# Altium project ECG Main Board.PrjPcb
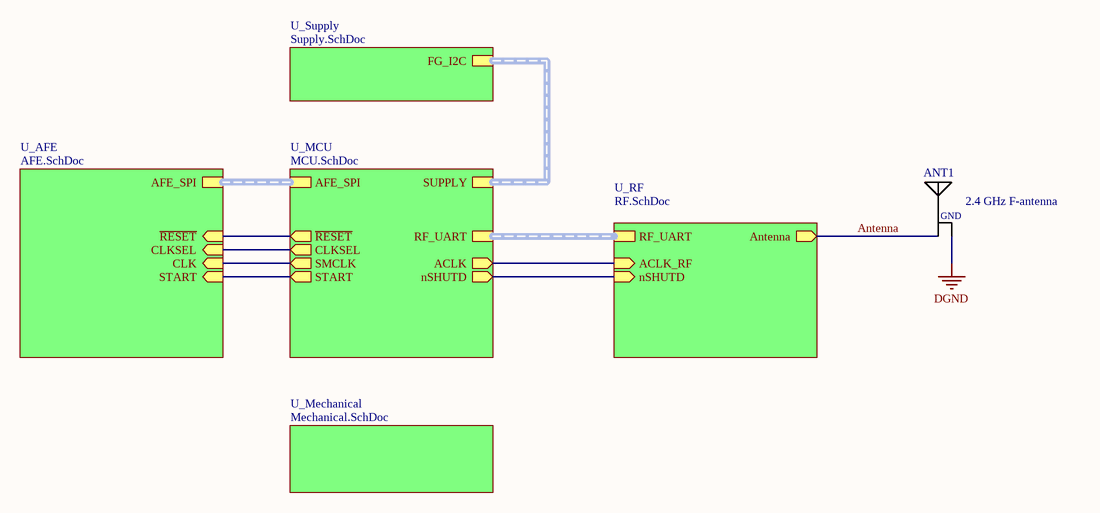
[diagram p0: Main Board.SchDoc]
6 sheets, 105 parts. Net scope: hierarchical (ports join the sheet entries above them; power ports are global).
Board file: Main Board.PcbDoc
Sheets:
  Main Board.SchDoc
    U_AFE = AFE.SchDoc
    U_MCU = MCU.SchDoc
    U_Supply = Supply.SchDoc
    U_RF = RF.SchDoc
    U_Mechanical = Mechanical.SchDoc

## Sheet Main Board.SchDoc: ECG Main Board
size A4; Author: Tomás Valencia/Samuel López; DrawnBy: Tomás Valencia; DocumentNumber: 1; SheetNumber: 1; SheetTotal: 6

### Parts
ANT1  2.4 GHz F-antenna  [Antenna]  (net tie, no BOM)

### Sub-sheets
U_AFE = AFE.SchDoc: AFE_SPI (harness AFE_SPI), CLKSEL (in), CLK (in), START (in), ~{RESET} (in)
U_MCU = MCU.SchDoc: AFE_SPI (harness AFE_SPI), RF_UART (harness RF_UART), ACLK (out), SUPPLY (harness SUPPLY), SMCLK (out), CLKSEL (out), START (out), nSHUTD (out), ~{RESET} (out)
U_Mechanical = Mechanical.SchDoc: no entries
U_RF = RF.SchDoc: RF_UART (harness RF_UART), ACLK_RF (in), Antenna (out), nSHUTD (in)
U_Supply = Supply.SchDoc: FG_I2C (harness SUPPLY)

### Nets
DGND: ANT1.2(GND)
ACLK_RF_DVDD: sheet U_MCU/ACLK, sheet U_RF/ACLK_RF
AFE_CLK: sheet U_AFE/CLK, sheet U_MCU/SMCLK
AFE_CLKSEL: sheet U_AFE/CLKSEL, sheet U_MCU/CLKSEL
AFE_RESET: sheet U_AFE/~{RESET}, sheet U_MCU/~{RESET}
AFE_START: sheet U_AFE/START, sheet U_MCU/START
Antenna: ANT1.1(IN) ; sheet U_RF/Antenna
nSHUTD_DVDD: sheet U_MCU/nSHUTD, sheet U_RF/nSHUTD

### Buses and harness runs
harness sheet U_AFE/AFE_SPI = sheet U_MCU/AFE_SPI
harness sheet U_MCU/RF_UART = sheet U_RF/RF_UART
harness sheet U_MCU/SUPPLY = sheet U_Supply/FG_I2C

### Library data of the parts
ANT1 = Antenna

## Sheet AFE.SchDoc: AFE
size A4; Author: Samuel López; DrawnBy: Samuel López; DocumentNumber: 2; SheetNumber: 2; SheetTotal: 6
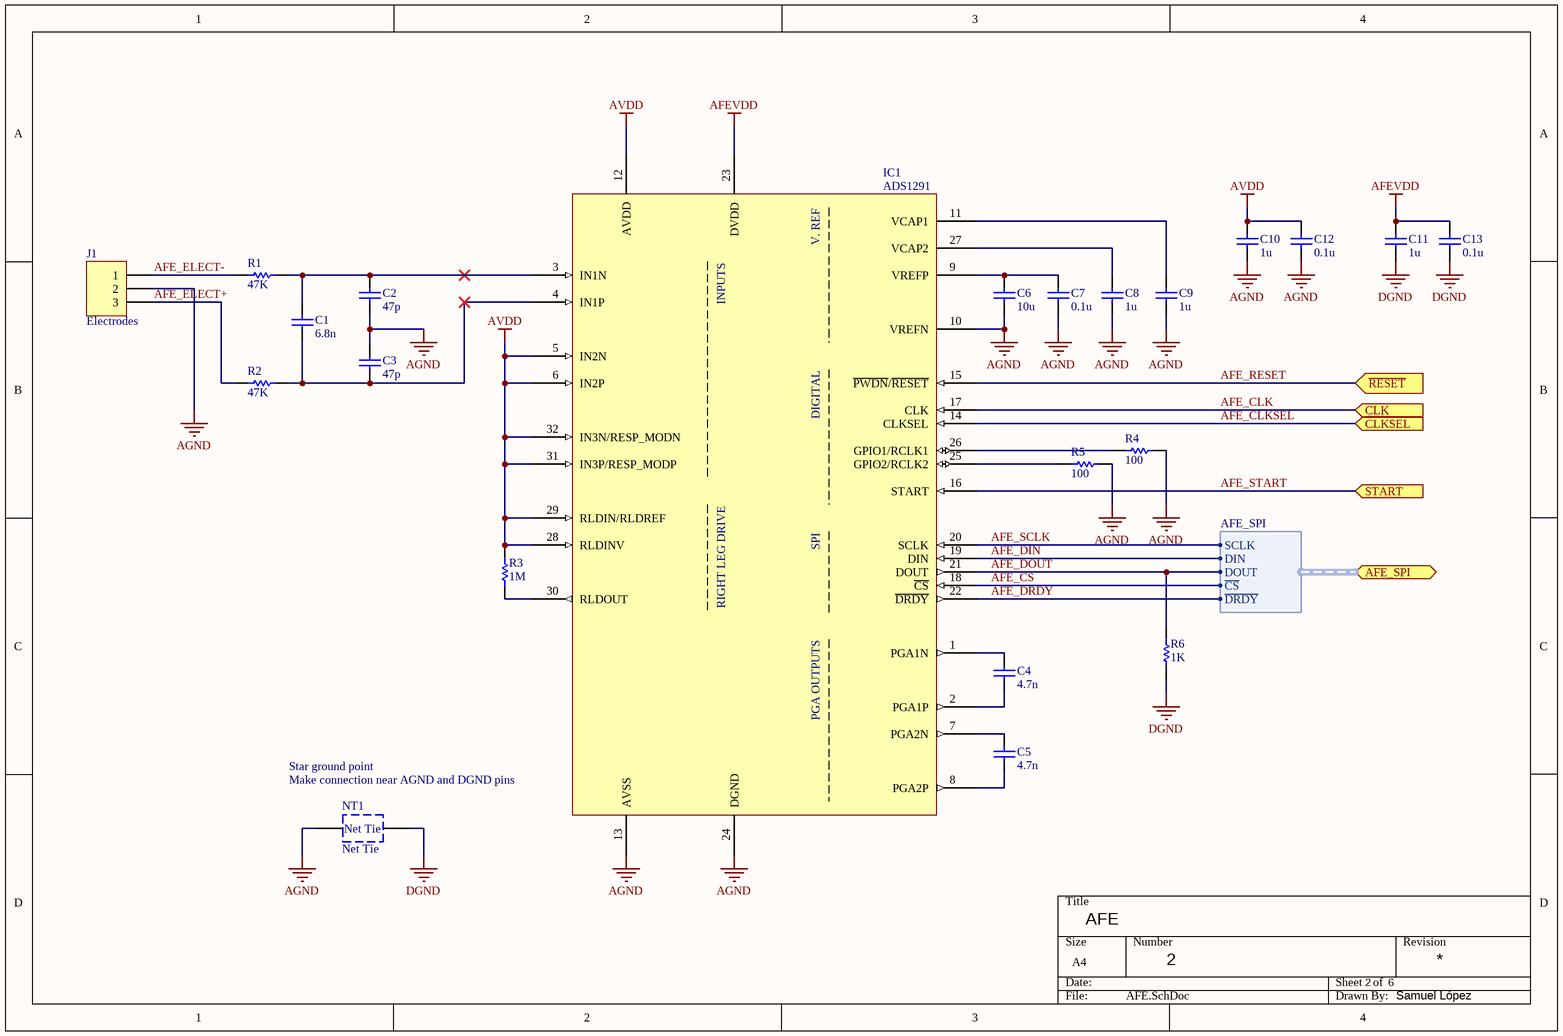
[diagram p1: AFE.SchDoc]

### Parts
C1  6.8n  [C0603]
C2  47p  [C0603]
C3  47p  [C0603]
C4  4.7n  [C0603]
C5  4.7n  [C0603]
C6  10u  [C0603]
C7  0.1u  [C0603]
C8  1u  [C0603]
C9  1u  [C0603]
C10  1u  [C0603]
C11  1u  [C0603]
C12  0.1u  [C0603]
C13  0.1u  [C0603]
IC1  ADS1291  [TSQFP50P700X700X120-32N]
J1  Electrodes  [JST PH 3 Socket]
NT1  Net Tie  [Net Tie (AGND-DGND)]  (net tie, no BOM)
R1  47K  [R0603]
R2  47K  [R0603]
R3  1M  [R0603]
R4  100  [R0603]
R5  100  [R0603]
R6  1K  [R0603]

### Ports
AFE_SPI (harness AFE_SPI), CLK (in), CLKSEL (in), START (in), ~{RESET} (in)

### Harnesses
AFE_SPI: SCLK, DIN, DOUT, ~{CS}, ~{DRDY}

### Nets
AFEVDD: C11.2 C13.2 IC1.23(DVDD)
AGND: C2.1 C3.2 C6.1 C7.1 C8.1 C9.1 C10.1 C12.1 IC1.10(VREFN) IC1.13(AVSS) IC1.24(DGND) J1.2 NT1.1 R4.2 R5.2
AVDD: C10.2 C12.2 IC1.5(IN2N) IC1.6(IN2P) IC1.12(AVDD) IC1.28(RLDINV) IC1.29(RLDIN/RLDREF) IC1.31(IN3P/RESP_MODP) IC1.32(IN3N/RESP_MODN) R3.2
DGND: C11.1 C13.1 NT1.2 R6.1
AFE_CLK: IC1.17(CLK) ; port CLK
AFE_CLKSEL: IC1.14(CLKSEL) ; port CLKSEL
AFE_CS: IC1.18(~{CS}) ; port AFE_SPI.~{CS}
AFE_DIN: IC1.19(DIN) ; port AFE_SPI.DIN
AFE_DOUT: IC1.21(DOUT) R6.2 ; port AFE_SPI.DOUT
AFE_DRDY: IC1.22(~{DRDY}) ; port AFE_SPI.~{DRDY}
AFE_ELECT+: J1.3 R2.1
AFE_ELECT-: J1.1 R1.1
AFE_RESET: IC1.15(~{PWDN}/~{RESET}) ; port ~{RESET}
AFE_SCLK: IC1.20(SCLK) ; port AFE_SPI.SCLK
AFE_START: IC1.16(START) ; port START
NetC1_1: C1.1 C3.1 IC1.4(IN1P) R2.2
NetC1_2: C1.2 C2.2 IC1.3(IN1N) R1.2
NetC4_1: C4.1 IC1.2(PGA1P)
NetC4_2: C4.2 IC1.1(PGA1N)
NetC5_1: C5.1 IC1.8(PGA2P)
NetC5_2: C5.2 IC1.7(PGA2N)
NetC6_2: C6.2 C7.2 IC1.9(VREFP)
NetC8_2: C8.2 IC1.27(VCAP2)
NetC9_2: C9.2 IC1.11(VCAP1)
NetIC1_25: IC1.25(GPIO2/RCLK2) R5.1
NetIC1_26: IC1.26(GPIO1/RCLK1) R4.1
NetIC1_30: IC1.30(RLDOUT) R3.1

### Notes on the sheet
- Star ground point
- Make connection near AGND and DGND pins
- (in symbol ADS1291) V. REF; INPUTS; DIGITAL; RIGHT LEG DRIVE; SPI; PGA OUTPUTS

### Library data of the parts
C1-C13 = Capacitor: Rated Voltage: *
  C1: Value: 6.8n
  C2 C3: Value: 47p
  C4 C5: Value: 4.7n
  C6: Value: 10u
  C7 C12 C13: Value: 0.1u
  C8-C11: Value: 1u
J1 = JST PH 3 Pin Socket: Supplier 1: Digi-Key; Supplier Part Number 1: 455-1720-ND
NT1 = Net Tie: Net Tie (AGND-DGND)
R1-R6 = Resistor: Power: *
  R1 R2: Value: 47K
  R3: Value: 1M
  R4 R5: Value: 100
  R6: Value: 1K
IC1 = ADS1291: Supplier 1: Digi-Key; Supplier Part Number 1: 296-36547-5-ND

## Sheet MCU.SchDoc: MCU
size A3; Author: Tomás Valencia; DrawnBy: Tomás Valencia; DocumentNumber: 3; SheetNumber: 3; SheetTotal: 6
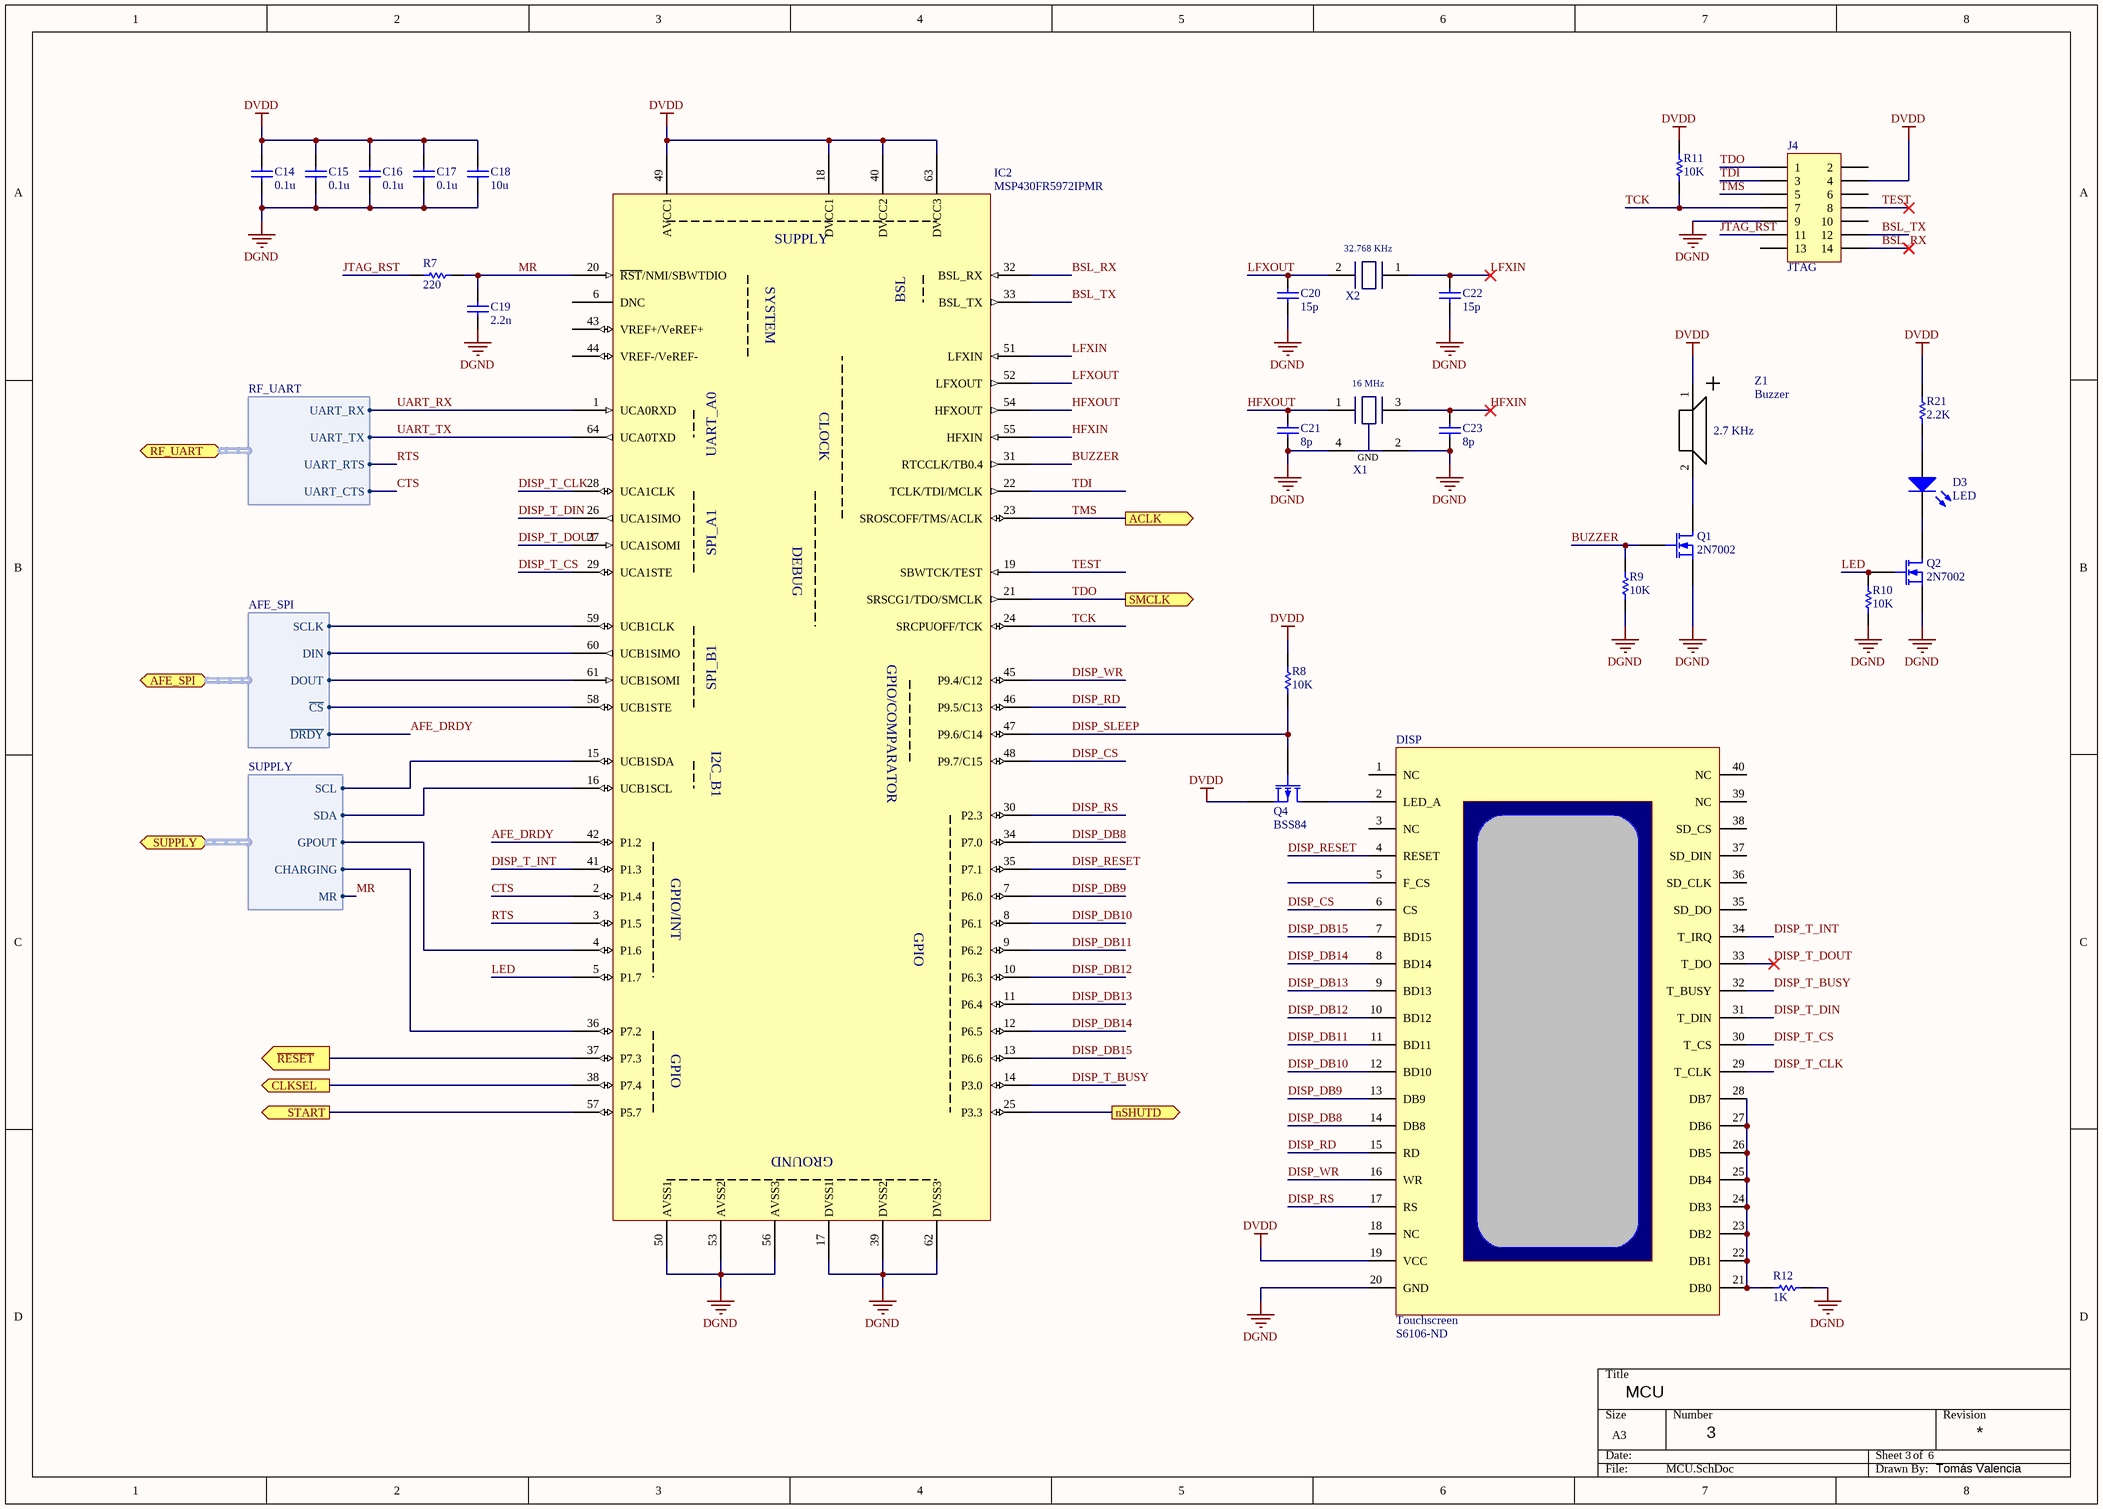
[diagram p2: MCU.SchDoc]

### Parts
C14  0.1u  [C0603]
C15  0.1u  [C0603]
C16  0.1u  [C0603]
C17  0.1u  [C0603]
C18  10u  [C0603]
C19  2.2n  [C0603]
C20  15p  [C0603]
C21  8p  [C0603]
C22  15p  [C0603]
C23  8p  [C0603]
D3  LED  [LED3015M]
DISP  Touchscreen  Supplier Part Number 1: S6106-ND  [TSCREEN_CONN]
IC2  MSP430FR5972IPMR  [MSP430FR5972]
J4  JTAG  [JTAG 14 PINS]
Q1  2N7002  [SOT65P210X110-3N]
Q2  2N7002  [SOT65P210X110-3N]
Q4  BSS84  [SOT65P210X110-3N]
R7  220  [R0603]
R8  10K  [R0603]
R9  10K  [R0603]
R10  10K  [R0603]
R11  10K  [R0603]
R12  1K  [R0603]
R21  2.2K  [R0603]
X1  XTAL_16MHZ  [XTAL_16_MHz]  (value not drawn)
X2  XTAL_32768  [xtal_32768]  (value not drawn)
Z1  Buzzer  [KSSG74B16]

### Ports
ACLK (out), AFE_SPI (harness AFE_SPI), CLKSEL (out), nSHUTD (out), RF_UART (harness RF_UART), SMCLK (out), START (out), SUPPLY (harness SUPPLY), ~{RESET} (out)

### Harnesses
AFE_SPI: SCLK, DIN, DOUT, ~{CS}, ~{DRDY}
RF_UART: UART_TX, UART_RX, UART_RTS, UART_CTS
SUPPLY: SDA, SCL, GPOUT, CHARGING, MR

### Nets
DGND: C14.1 C15.1 C16.1 C17.1 C18.1 C19.1 C20.2 C21.1 C22.2 C23.1 DISP.20(GND) IC2.17(DVSS1) IC2.39(DVSS2) IC2.50(AVSS1) IC2.53(AVSS2) IC2.56(AVSS3) IC2.62(DVSS3) J4.9 Q1.2(S) Q2.2(S) R9.1 R10.1 R12.2 X1.2(GND) X1.4(GND)
DVDD: C14.2 C15.2 C16.2 C17.2 C18.2 DISP.19(VCC) IC2.18(DVCC1) IC2.40(DVCC2) IC2.49(AVCC1) IC2.63(DVCC3) J4.4 Q4.2(S) R8.2 R11.2 R21.2 Z1.1(+)
AFE_CLKSEL: IC2.38(P7.4) ; port CLKSEL
AFE_CS: IC2.58(UCB1STE) ; port AFE_SPI.~{CS}
AFE_DIN: IC2.60(UCB1SIMO) ; port AFE_SPI.DIN
AFE_DOUT: IC2.61(UCB1SOMI) ; port AFE_SPI.DOUT
AFE_DRDY: IC2.42(P1.2) ; port AFE_SPI.~{DRDY}
AFE_RESET: IC2.37(P7.3) ; port ~{RESET}
AFE_SCLK: IC2.59(UCB1CLK) ; port AFE_SPI.SCLK
AFE_START: IC2.57(P5.7) ; port START
BSL_RX: IC2.32(BSL_RX) J4.14
BSL_TX: IC2.33(BSL_TX) J4.12
BUZZER: IC2.31(RTCCLK/TB0.4) Q1.1(G) R9.2
Charging: IC2.36(P7.2) ; port SUPPLY.CHARGING
CTS: IC2.2(P1.4) ; port RF_UART.UART_CTS
DISP_CS: DISP.6(CS) IC2.48(P9.7/C15)
DISP_DB8: DISP.14(DB8) IC2.34(P7.0)
DISP_DB9: DISP.13(DB9) IC2.7(P6.0)
DISP_DB10: DISP.12(BD10) IC2.8(P6.1)
DISP_DB11: DISP.11(BD11) IC2.9(P6.2)
DISP_DB12: DISP.10(BD12) IC2.10(P6.3)
DISP_DB13: DISP.9(BD13) IC2.11(P6.4)
DISP_DB14: DISP.8(BD14) IC2.12(P6.5)
DISP_DB15: DISP.7(BD15) IC2.13(P6.6)
DISP_RD: DISP.15(RD) IC2.46(P9.5/C13)
DISP_RESET: DISP.4(RESET) IC2.35(P7.1)
DISP_RS: DISP.17(RS) IC2.30(P2.3)
DISP_SLEEP: IC2.47(P9.6/C14) Q4.1(G) R8.1
DISP_T_BUSY: DISP.32(T_BUSY) IC2.14(P3.0)
DISP_T_CLK: DISP.29(T_CLK) IC2.28(UCA1CLK)
DISP_T_CS: DISP.30(T_CS) IC2.29(UCA1STE)
DISP_T_DIN: DISP.31(T_DIN) IC2.26(UCA1SIMO)
DISP_T_DOUT: DISP.33(T_DO) IC2.27(UCA1SOMI)
DISP_T_INT: DISP.34(T_IRQ) IC2.41(P1.3)
DISP_WR: DISP.16(WR) IC2.45(P9.4/C12)
GPOUT: IC2.4(P1.6) ; port SUPPLY.GPOUT
HFXIN: C23.2 IC2.55(HFXIN) X1.3(IN)
HFXOUT: C21.2 IC2.54(HFXOUT) X1.1(OUT)
JTAG_RST: J4.11 R7.1
LED: IC2.5(P1.7) Q2.1(G) R10.2
LFXIN: C22.1 IC2.51(LFXIN) X2.1(IN)
LFXOUT: C20.1 IC2.52(LFXOUT) X2.2(OUT)
MR: C19.2 IC2.20(~{RST}/NMI/SBWTDIO) R7.2 ; port SUPPLY.MR
nSHUTD_DVDD: IC2.25(P3.3) ; port nSHUTD
RTS: IC2.3(P1.5) ; port RF_UART.UART_RTS
SCL: IC2.15(UCB1SDA) ; port SUPPLY.SCL
SDA: IC2.16(UCB1SCL) ; port SUPPLY.SDA
TCK: IC2.24(SRCPUOFF/TCK) J4.7 R11.1
TDI: IC2.22(TCLK/TDI/MCLK) J4.3
TDO: IC2.21(SRSCG1/TDO/SMCLK) J4.1 ; port SMCLK  [project net AFE_CLK]
TEST: IC2.19(SBWTCK/TEST) J4.8
TMS: IC2.23(SROSCOFF/TMS/ACLK) J4.5 ; port ACLK  [project net ACLK_RF_DVDD]
UART_RX: IC2.1(UCA0RXD) ; port RF_UART.UART_RX
UART_TX: IC2.64(UCA0TXD) ; port RF_UART.UART_TX
NetD3_1: D3.1(A) R21.1
NetD3_2: D3.2(K) Q2.3(D)
NetDISP_2: DISP.2(LED_A) Q4.3(D)
NetDISP_21: DISP.21(DB0) DISP.22(DB1) DISP.23(DB2) DISP.24(DB3) DISP.25(DB4) DISP.26(DB5) DISP.27(DB6) DISP.28(DB7) R12.1
NetQ1_3: Q1.3(D) Z1.2(-)

Not connected (* = marked no-connect by the designer): DISP 1(NC) 3(NC) 5(F_CS) 18(NC) 35(SD_DO) 36(SD_CLK) 37(SD_DIN) 38(SD_CS) 39(NC) 40(NC); IC2 6(DNC) 43(VREF+/VeREF+) 44(VREF-/VeREF-); J4 2 6 10 13

### Notes on the sheet
- (in symbol Buzzer) 2.7 KHz
- (in symbol MSP430FR5972IPMR) SUPPLY; BSL; SYSTEM; UART_A0; CLOCK; SPI_A1; DEBUG; SPI_B1; GPIO/COMPARATOR; I2C_B1; GPIO/INT; GPIO; GROUND
- (in symbol XTAL_16_MHz) 16 MHz
- (in symbol XTAL_32768) 32.768 KHz

### Library data of the parts
C14-C23 = Capacitor: Rated Voltage: *
  C14-C17: Value: 0.1u
  C18: Value: 10u
  C19: Value: 2.2n
  C20 C22: Value: 15p
  C21 C23: Value: 8p
J4 = JTAG 14 Pins: JTAG 7X2 Pin Header 90º; Supplier 1: Digi-Key; Supplier Part Number 1: ED10534-ND
Q1 Q2 = 2N7002: Transistor, MOSFET, N-Channel, 60V, 300mA
Q4 = BSS84: Transistor, MOSFET, P-Channel, 60V, 300mA
R7-R12 R21 = Resistor: Power: *
  R7: Value: 220
  R8-R11: Value: 10K
  R12: Value: 1K
  R21: Value: 2.2K
X1 = XTAL_16_MHz
Z1 = Buzzer: Magnetic Buzzer 2.7 KHz; Supplier 1: Farnell; Supplier Part Number 1: 2215090
D3 = LED: Supplier 1: Farnell; Supplier 2: Farnell; Supplier 3: Farnell; Supplier 4: Farnell; Supplier Part Number 1: 2426228; Supplier Part Number 2: 2426227; Supplier Part Number 3: 2426230; Supplier Part Number 4: 2426229
DISP = Touchscreen: Supplier 1: Digi-Key
X2 = XTAL_32768: Supplier 1: Digi-Key; Supplier Part Number 1: 535-9032-ND

## Sheet Supply.SchDoc: Supply
size A4; Author: Tomás Valencia; DrawnBy: Tomás Valencia; DocumentNumber: 5; SheetNumber: 5; SheetTotal: 6
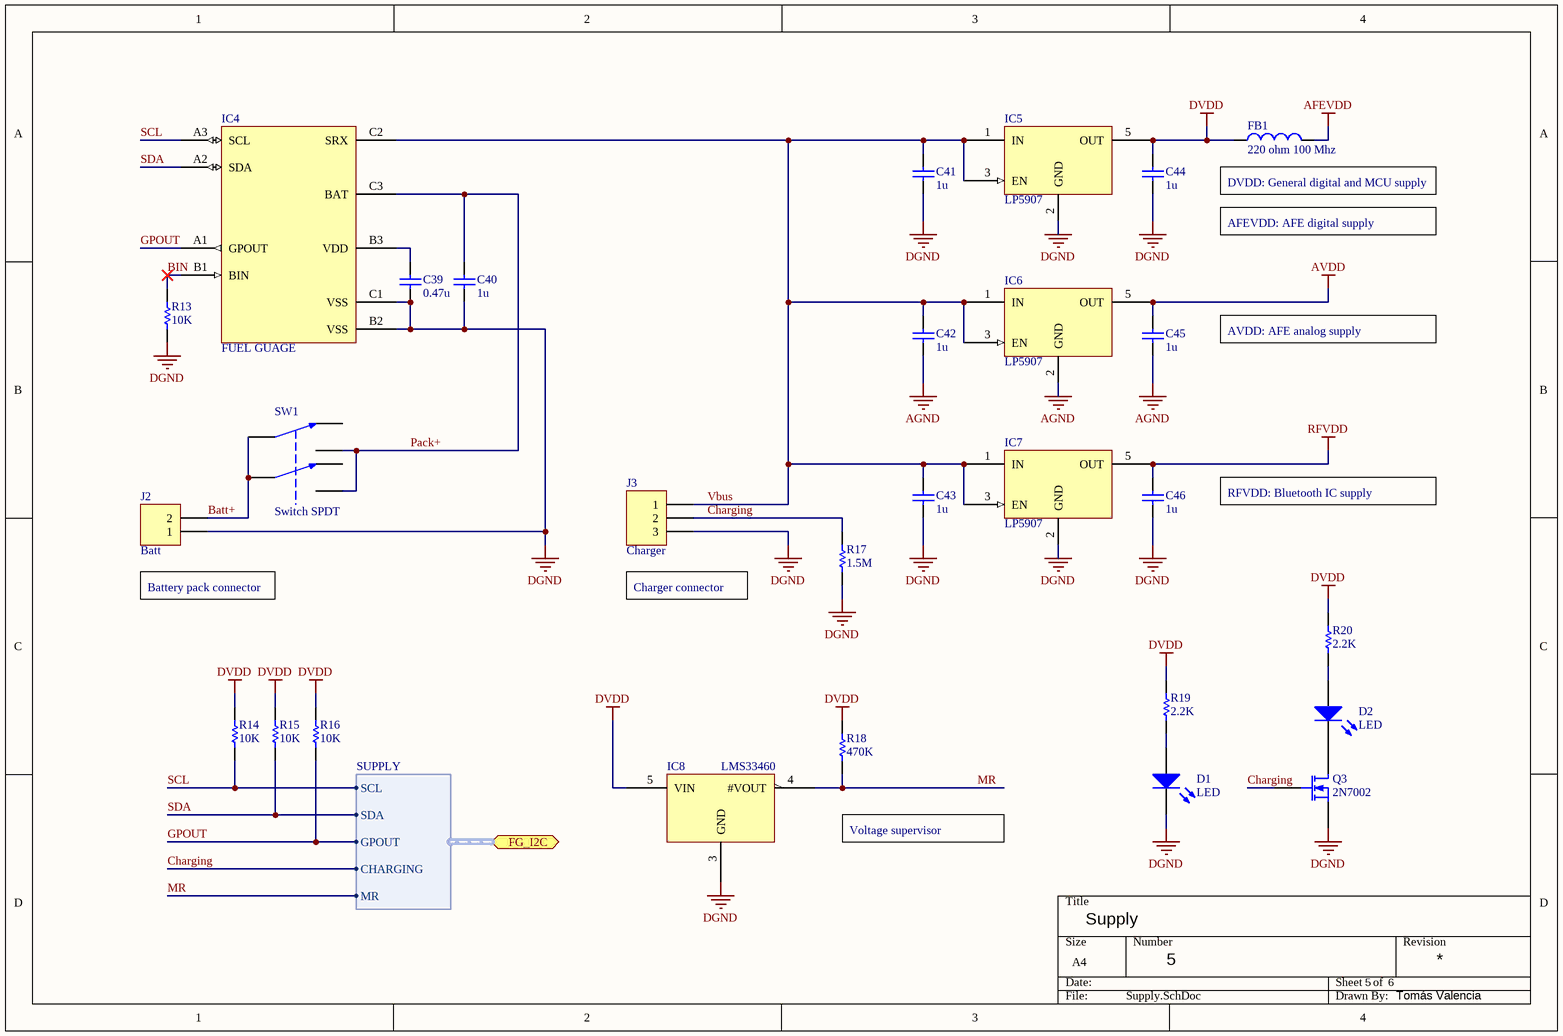
[diagram p3: Supply.SchDoc]

### Parts
C39  0.47u  [C0603]
C40  1u  [C0603]
C41  1u  [C0603]
C42  1u  [C0603]
C43  1u  [C0603]
C44  1u  [C0603]
C45  1u  [C0603]
C46  1u  [C0603]
D1  LED  [LED3015M]
D2  LED  [LED3015M]
FB1  220 ohm 100 Mhz  [0805 Ind]
IC4  FUEL GUAGE  [BQ27421]
IC5  LP5907  [SOT23]
IC6  LP5907  [SOT23]
IC7  LP5907  [SOT23]
IC8  LMS33460  [LMS33460]
J2  Batt  [JST PH 2 Socket]
J3  Charger  [JST PH 3 Socket]
Q3  2N7002  [SOT65P210X110-3N]
R13  10K  [R0603]
R14  10K  [R0603]
R15  10K  [R0603]
R16  10K  [R0603]
R17  1.5M  [R0603]
R18  470K  [R0603]
R19  2.2K  [R0603]
R20  2.2K  [R0603]
SW1  Switch SPDT  [MFS201N-16-Z]

### Ports
FG_I2C (harness SUPPLY)

### Harnesses
SUPPLY: SDA, SCL, GPOUT, CHARGING, MR

### Nets
AFEVDD: FB1.2
AGND: C42.1 C45.1 IC6.2(GND)
AVDD: C45.2 IC6.5(OUT)
DGND: C39.1 C40.1 C41.1 C43.1 C44.1 C46.1 D1.2(K) IC4.B2(VSS) IC4.C1(VSS) IC5.2(GND) IC7.2(GND) IC8.3(GND) J2.1 J3.3 Q3.2(S) R13.1 R17.1
DVDD: C44.2 FB1.1 IC5.5(OUT) IC8.5(VIN) R14.2 R15.2 R16.2 R18.2 R19.2 R20.2
RFVDD: C46.2 IC7.5(OUT)
Batt+: J2.2 SW1.2 SW1.5
BIN: IC4.B1(BIN) R13.2
Charging: J3.2 Q3.1(G) R17.2 ; port FG_I2C.CHARGING
GPOUT: IC4.A1(GPOUT) R16.1 ; port FG_I2C.GPOUT
MR: IC8.4(#VOUT) R18.1 ; port FG_I2C.MR
Pack+: C40.2 IC4.C3(BAT) SW1.3 SW1.6
SCL: IC4.A3(SCL) R14.1 ; port FG_I2C.SCL
SDA: IC4.A2(SDA) R15.1 ; port FG_I2C.SDA
Vbus: C41.2 C42.2 C43.2 IC4.C2(SRX) IC5.1(IN) IC5.3(EN) IC6.1(IN) IC6.3(EN) IC7.1(IN) IC7.3(EN) J3.1
NetC39_2: C39.2 IC4.B3(VDD)
NetD1_1: D1.1(A) R19.1
NetD2_1: D2.1(A) R20.1
NetD2_2: D2.2(K) Q3.3(D)

Not connected (* = marked no-connect by the designer): SW1 1 4

### Notes on the sheet
- (near FB1) DVDD: General digital and MCU supply
- AFEVDD: AFE digital supply
- AVDD: AFE analog supply
- RFVDD: Bluetooth IC supply
- (near J2) Battery pack connector
- (near J3) Charger connector
- Voltage supervisor

### Library data of the parts
C39 C42 C43 C45 C46 = Capacitor: Value: 100p; Rated Voltage: *
C40 C41 C44 = Capacitor: Value: 1u; Rated Voltage: *
FB1 = Ferrita: INDUCTOR, 0.04OHM, 3A, 0805; Value: 220 ohm 100 Mhz
IC4 = BQ27421: Supplier 1: Digi-Key; Supplier Part Number 1: 296-38880-1-ND
J2 = JST PH 2 Pin Socket: Supplier 1: Digi-Key; Supplier Part Number 1: 455-1719-ND
J3 = JST PH 3 Pin Socket: Supplier 1: Digi-Key; Supplier Part Number 1: 455-1720-ND
Q3 = 2N7002: as Q1 on sheet MCU
R13-R20 = Resistor: Power: *
  R13-R16: Value: 10K
  R17: Value: 1.5M
  R18: Value: 470K
  R19 R20: Value: 2.2K
SW1 = MFS201N-16-Z: Supplier 1: Digi-Key; Supplier Part Number 1: 563-1558-ND
D1 D2 = LED: Supplier 1: Farnell; Supplier 2: Farnell; Supplier 3: Farnell; Supplier 4: Farnell; Supplier Part Number 1: 2426228; Supplier Part Number 2: 2426227; Supplier Part Number 3: 2426230; Supplier Part Number 4: 2426229
IC5-IC7 = LP5907: Supplier 1: Digi-Key; Supplier Part Number 1: 296-38557-1-ND
IC8 = LMS33460: Supplier 1: Digi-Key; Supplier Part Number 1: LMS33460MG/NOPBCT-ND

## Sheet RF.SchDoc: RF
size A3; Author: Tomás Valencia; DrawnBy: Tomás Valencia; DocumentNumber: 4; SheetNumber: 4; SheetTotal: 6
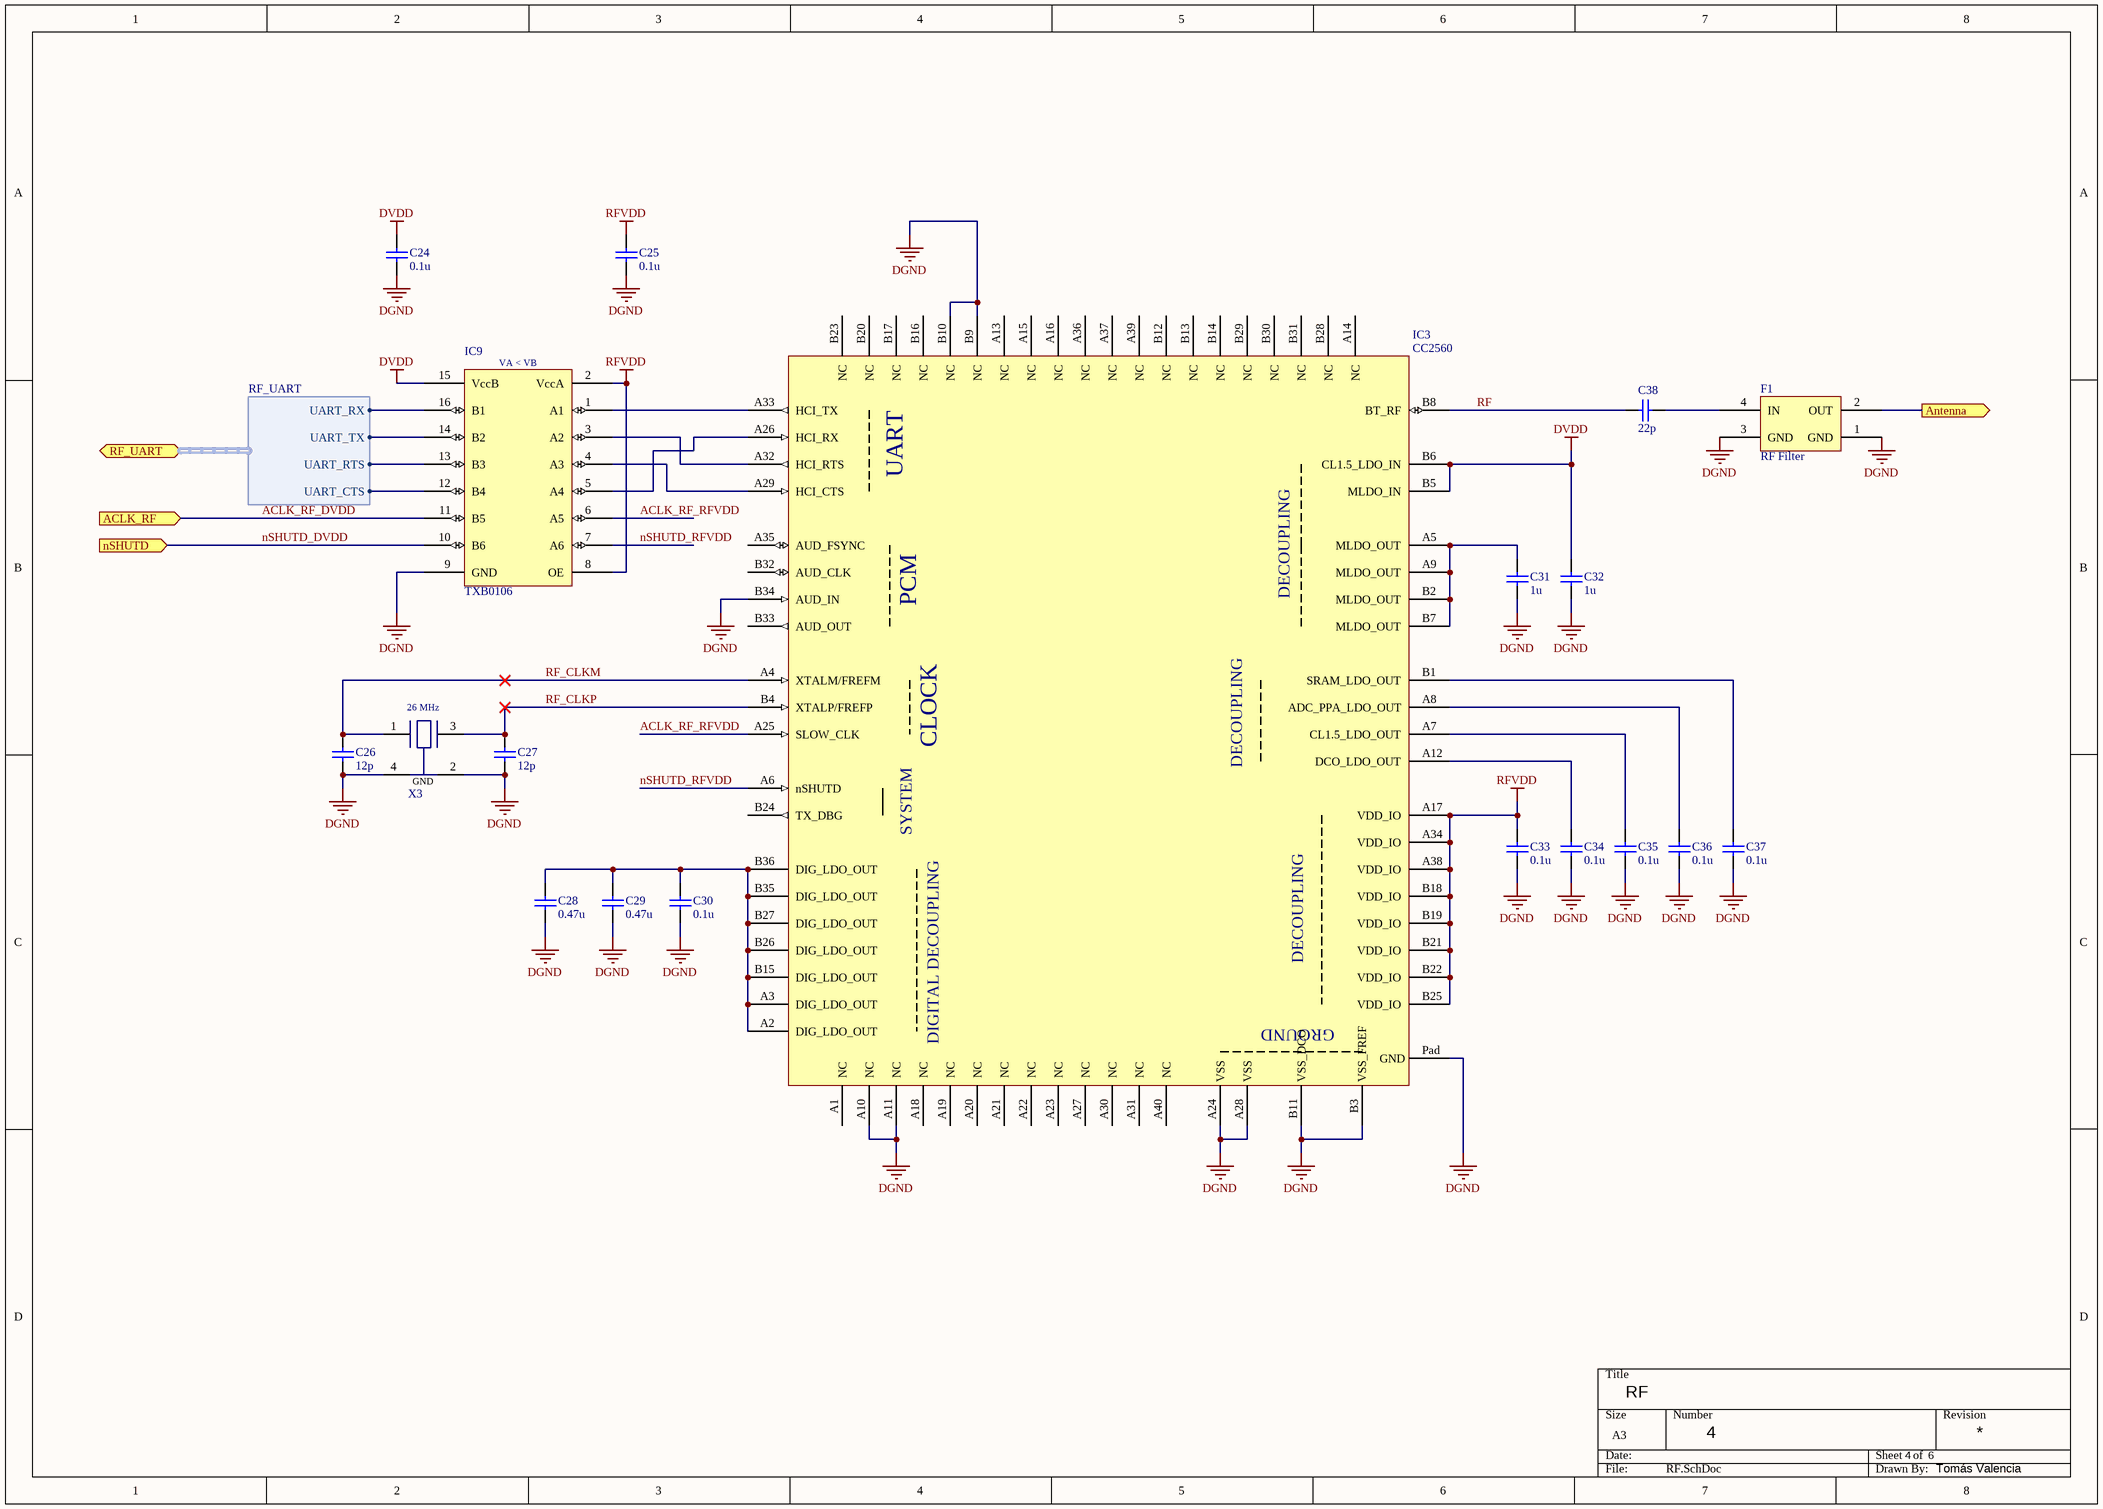
[diagram p4: RF.SchDoc]

### Parts
C24  0.1u  [C0603]
C25  0.1u  [C0603]
C26  12p  [C0603]
C27  12p  [C0603]
C28  0.47u  [C0603]
C29  0.47u  [C0603]
C30  0.1u  [C0603]
C31  1u  [C0603]
C32  1u  [C0603]
C33  0.1u  [C0603]
C34  0.1u  [C0603]
C35  0.1u  [C0603]
C36  0.1u  [C0603]
C37  0.1u  [C0603]
C38  22p  [C0603]
F1  RF Filter  [LFB212G45SG8A127]
IC3  CC2560  [CC2560]
IC9  TXB0106  [TXB0106]
X3  XTAL_26_MHz  [XTAL_26MHZ]  (value not drawn)

### Ports
ACLK_RF (in), Antenna (out), nSHUTD (in), RF_UART (harness RF_UART)

### Harnesses
RF_UART: UART_TX, UART_RX, UART_RTS, UART_CTS

### Nets
DGND: C24.1 C25.1 C26.1 C27.1 C28.1 C29.1 C30.1 C31.1 C32.1 C33.1 C34.1 C35.1 C36.1 C37.1 F1.1(GND) F1.3(GND) IC3.A10(NC) IC3.A11(NC) IC3.A24(VSS) IC3.A28(VSS) IC3.B3(VSS_FREF) IC3.B9(NC) IC3.B10(NC) IC3.B11(VSS_DCO) IC3.B34(AUD_IN) IC3.Pad(GND) IC9.9(GND) X3.2(GND) X3.4(GND)
DVDD: C24.2 C32.2 IC3.B5(MLDO_IN) IC3.B6(CL1.5_LDO_IN) IC9.15(VccB)
RFVDD: C25.2 C33.2 IC3.A17(VDD_IO) IC3.A34(VDD_IO) IC3.A38(VDD_IO) IC3.B18(VDD_IO) IC3.B19(VDD_IO) IC3.B21(VDD_IO) IC3.B22(VDD_IO) IC3.B25(VDD_IO) IC9.2(VccA) IC9.8(OE)
ACLK_RF_DVDD: IC9.11(B5) ; port ACLK_RF
ACLK_RF_RFVDD: IC3.A25(SLOW_CLK) IC9.6(A5)
Antenna: F1.2(OUT) ; port Antenna
CTS: IC9.12(B4) ; port RF_UART.UART_CTS
nSHUTD_DVDD: IC9.10(B6) ; port nSHUTD
nSHUTD_RFVDD: IC3.A6(nSHUTD) IC9.7(A6)
RF: C38.1 IC3.B8(BT_RF)
RF_CLKM: C26.2 IC3.A4(XTALM/FREFM) X3.1(OUT)
RF_CLKP: C27.2 IC3.B4(XTALP/FREFP) X3.3(IN)
RTS: IC9.13(B3) ; port RF_UART.UART_RTS
UART_RX: IC9.16(B1) ; port RF_UART.UART_RX
UART_TX: IC9.14(B2) ; port RF_UART.UART_TX
NetC28_2: C28.2 C29.2 C30.2 IC3.A2(DIG_LDO_OUT) IC3.A3(DIG_LDO_OUT) IC3.B15(DIG_LDO_OUT) IC3.B26(DIG_LDO_OUT) IC3.B27(DIG_LDO_OUT) IC3.B35(DIG_LDO_OUT) IC3.B36(DIG_LDO_OUT)
NetC31_2: C31.2 IC3.A5(MLDO_OUT) IC3.A9(MLDO_OUT) IC3.B2(MLDO_OUT) IC3.B7(MLDO_OUT)
NetC34_2: C34.2 IC3.A12(DCO_LDO_OUT)
NetC35_2: C35.2 IC3.A7(CL1.5_LDO_OUT)
NetC36_2: C36.2 IC3.A8(ADC_PPA_LDO_OUT)
NetC37_2: C37.2 IC3.B1(SRAM_LDO_OUT)
NetC38_2: C38.2 F1.4(IN)
NetIC3_A26: IC3.A26(HCI_RX) IC9.5(A4)
NetIC3_A29: IC3.A29(HCI_CTS) IC9.4(A3)
NetIC3_A32: IC3.A32(HCI_RTS) IC9.3(A2)
NetIC3_A33: IC3.A33(HCI_TX) IC9.1(A1)

Not connected (* = marked no-connect by the designer): IC3 A1(NC) A13(NC) A14(NC) A15(NC) A16(NC) A18(NC) A19(NC) A20(NC) A21(NC) A22(NC) A23(NC) A27(NC) A30(NC) A31(NC) A35(AUD_FSYNC) A36(NC) A37(NC) A39(NC) A40(NC) B12(NC) B13(NC) B14(NC) B16(NC) B17(NC) B20(NC) B23(NC) B24(TX_DBG) B28(NC) B29(NC) B30(NC) B31(NC) B32(AUD_CLK) B33(AUD_OUT)

### Notes on the sheet
- (in symbol CC2560) UART; DECOUPLING; PCM; CLOCK; SYSTEM; GROUND; DIGITAL DECOUPLING
- (in symbol TXB0106) VA < VB
- (in symbol XTAL_26_MHz) 26 MHz

### Library data of the parts
C24-C38 = Capacitor: Rated Voltage: *
  C24 C25 C30 C33-C37: Value: 0.1u
  C26 C27: Value: 12p
  C28 C29: Value: 0.47u
  C31 C32: Value: 1u
  C38: Value: 22p
F1 = LFB212G45SG8A127: RF Filter 2.4 GHz

## Sheet Mechanical.SchDoc: Mechanical
size A4; Author: Samuel López; DrawnBy: Samuel López; DocumentNumber: 6; SheetNumber: 6; SheetTotal: 6
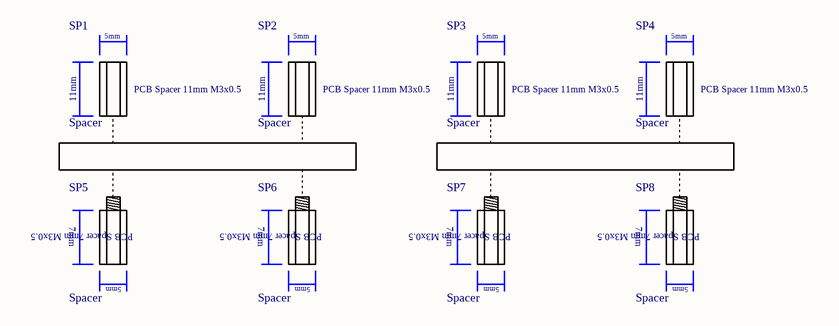
[diagram p5: Mechanical.SchDoc]

### Parts
SP1  Spacer  [Spacer 11mm M3x0.5]
SP2  Spacer  [Spacer 11mm M3x0.5]
SP3  Spacer  [Spacer 11mm M3x0.5]
SP4  Spacer  [Spacer 11mm M3x0.5]
SP5  Spacer  [Spacer 7mm M3x0.5 Screw]
SP6  Spacer  [Spacer 7mm M3x0.5 Screw]
SP7  Spacer  [Spacer 7mm M3x0.5 Screw]
SP8  Spacer  [Spacer 7mm M3x0.5 Screw]

### Notes on the sheet
- (in symbol Spacer 7mm M3x0.5 Screw) 7mm; PCB Spacer 7mm M3x0.5; 5mm
- (in symbol Spacer 11mm M3x0.5) 5mm; 11mm

### Library data of the parts
SP1-SP4 = Spacer 11mm M3x0.5: PCB Spacer 11mm M3x0.5; Supplier 1: Digi-Key; Supplier Part Number 1: 952-2312-ND
SP5-SP8 = Spacer 7mm M3x0.5 Screw: PCB Spacer 7mm M3x0.5 Screw; Supplier 1: Digi-Key; Supplier Part Number 1: 952-1498-ND

## Nets that join several sheets
AFEVDD: AFE (C11.2 C13.2 IC1.23), Supply (FB1.2)
AGND: AFE (15 pins), Supply (C42.1 C45.1 IC6.2)
AVDD: AFE (10 pins), Supply (C45.2 IC6.5)
DGND: Main Board (ANT1.2), AFE (C11.1 C13.1 NT1.2 R6.1), MCU (25 pins), Supply (17 pins), RF (29 pins)
DVDD: MCU (16 pins), Supply (10 pins), RF (5 pins)
RFVDD: Supply (C46.2 IC7.5), RF (12 pins)
ACLK_RF_DVDD: MCU (IC2.23 J4.5), RF (IC9.11)
AFE_CLK: AFE (IC1.17), MCU (IC2.21 J4.1)
AFE_CLKSEL: AFE (IC1.14), MCU (IC2.38)
AFE_CS: AFE (IC1.18), MCU (IC2.58)
AFE_DIN: AFE (IC1.19), MCU (IC2.60)
AFE_DOUT: AFE (IC1.21 R6.2), MCU (IC2.61)
AFE_DRDY: AFE (IC1.22), MCU (IC2.42)
AFE_RESET: AFE (IC1.15), MCU (IC2.37)
AFE_SCLK: AFE (IC1.20), MCU (IC2.59)
AFE_START: AFE (IC1.16), MCU (IC2.57)
Antenna: Main Board (ANT1.1), RF (F1.2)
Charging: MCU (IC2.36), Supply (J3.2 Q3.1 R17.2)
CTS: MCU (IC2.2), RF (IC9.12)
GPOUT: MCU (IC2.4), Supply (IC4.A1 R16.1)
MR: MCU (C19.2 IC2.20 R7.2), Supply (IC8.4 R18.1)
nSHUTD_DVDD: MCU (IC2.25), RF (IC9.10)
RTS: MCU (IC2.3), RF (IC9.13)
SCL: MCU (IC2.15), Supply (IC4.A3 R14.1)
SDA: MCU (IC2.16), Supply (IC4.A2 R15.1)
UART_RX: MCU (IC2.1), RF (IC9.16)
UART_TX: MCU (IC2.64), RF (IC9.14)